# EAGLE schematic Module_SOSI_OS5000_datalogger (EAGLE 6.5.0)
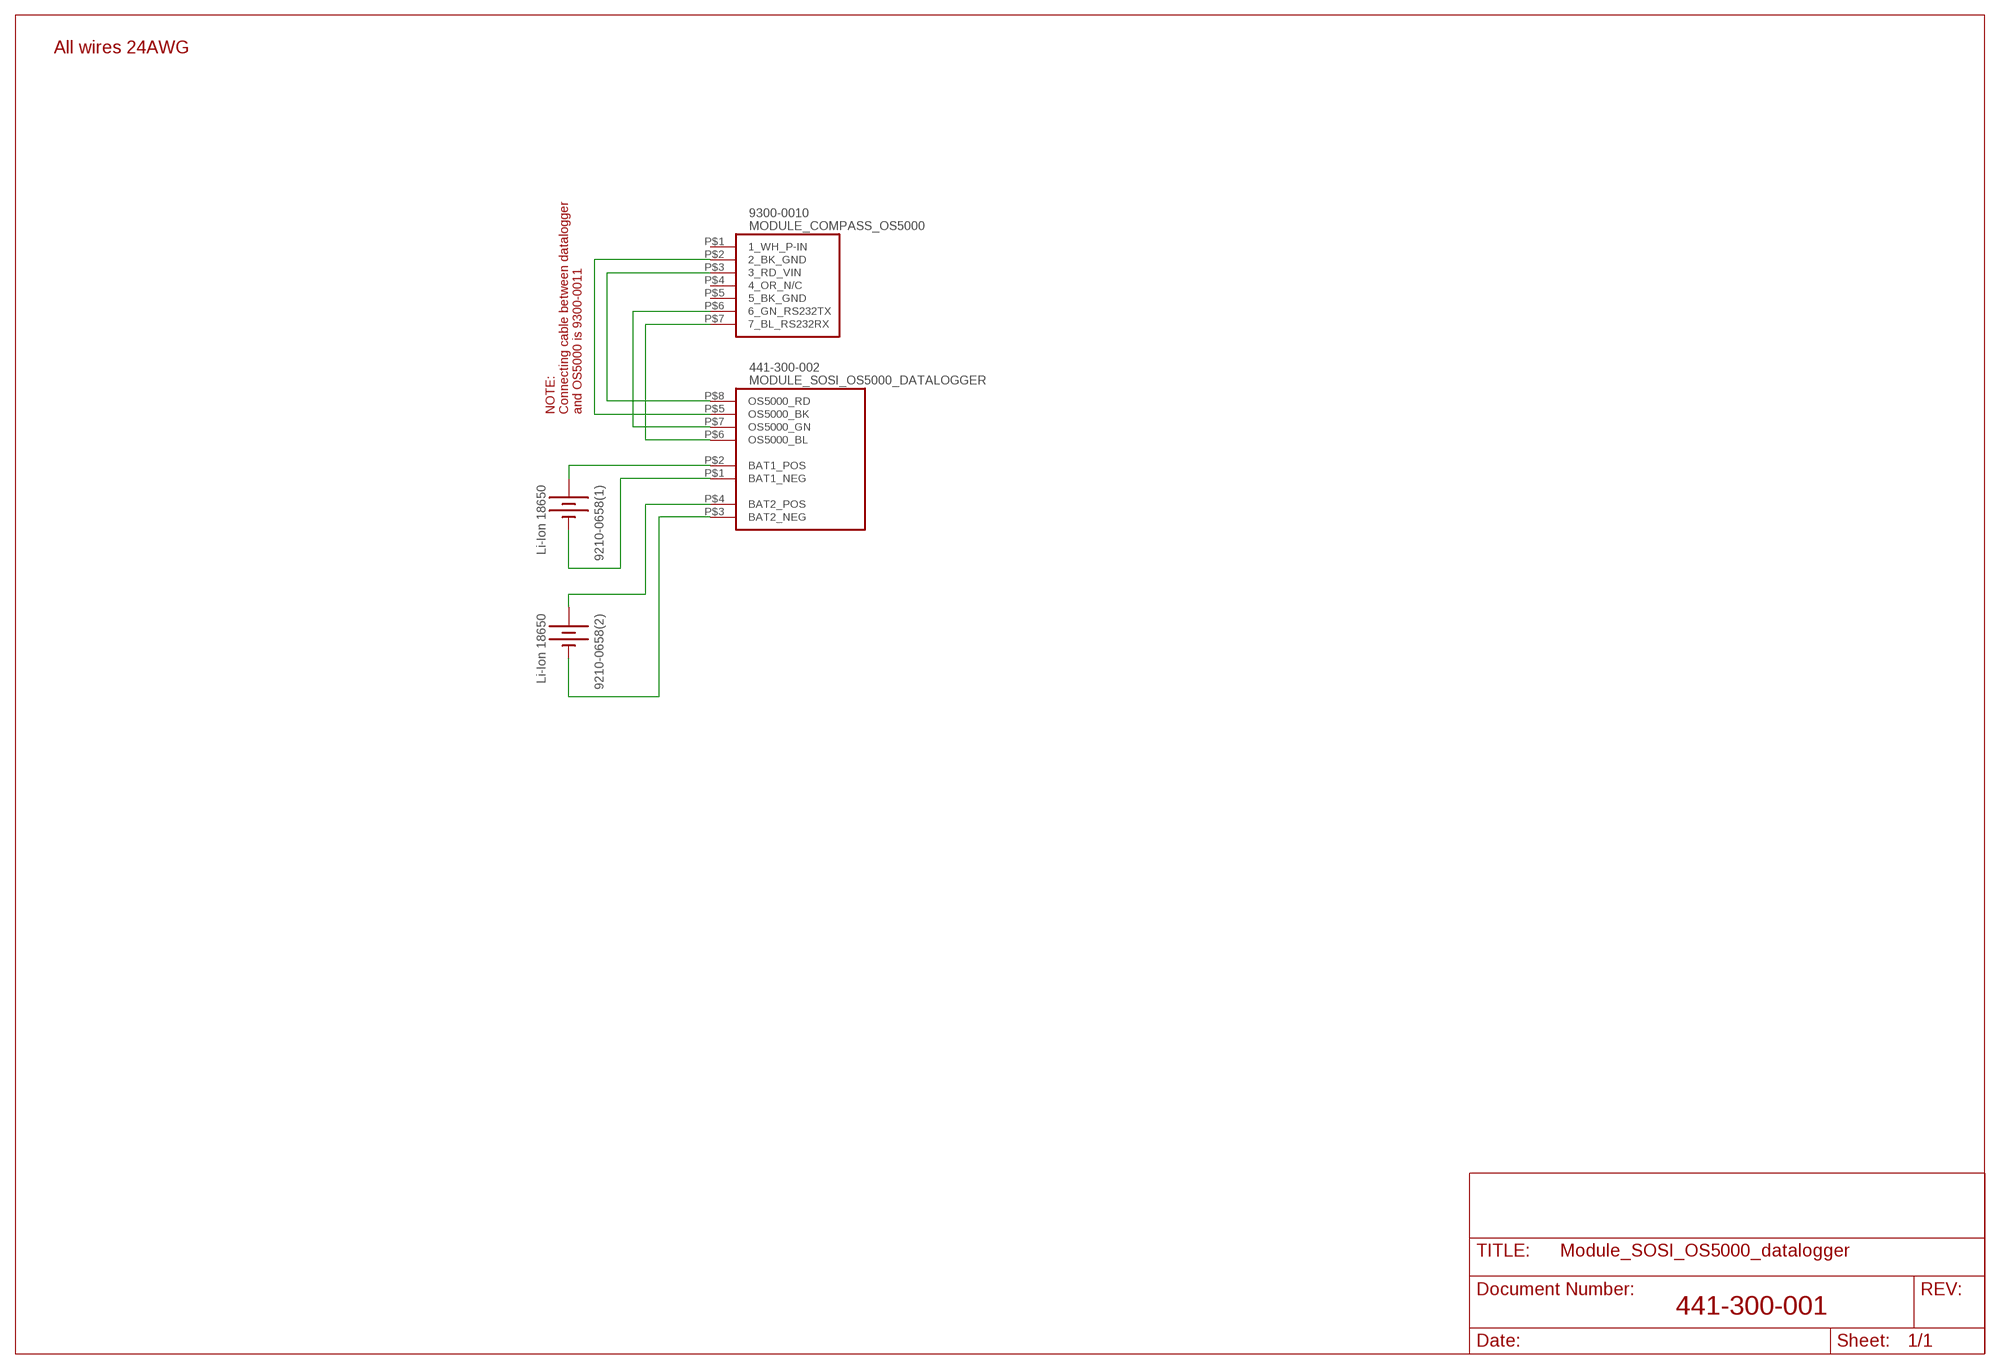
[diagram p0: schematic, sheet 1]

## Parts
441-300-002  MODULE_SOSI_OS5000_DATALOGGER  [BOGUS]
9210-0658(1)  Li-Ion 18650  BATTERY  [BOGUS]
9210-0658(2)  Li-Ion 18650  BATTERY  [BOGUS]
9300-0010  MODULE_COMPASS_OS5000  [BOGUS]

## Nets
N$1: 441-300-002.P$5(OS5000_BK) 9300-0010.P$2(2_BK_GND)
N$2: 441-300-002.P$8(OS5000_RD) 9300-0010.P$3(3_RD_VIN)
N$3: 441-300-002.P$7(OS5000_GN) 9300-0010.P$6(6_GN_RS232TX)
N$4: 441-300-002.P$6(OS5000_BL) 9300-0010.P$7(7_BL_RS232RX)
N$5: 441-300-002.P$2(BAT1_POS) 9210-0658(1).P$1(+)
N$6: 441-300-002.P$1(BAT1_NEG) 9210-0658(1).P$2(-)
N$7: 441-300-002.P$4(BAT2_POS) 9210-0658(2).P$1(+)
N$8: 441-300-002.P$3(BAT2_NEG) 9210-0658(2).P$2(-)
Unconnected: 9300-0010.P$1(1_WH_P-IN) 9300-0010.P$4(4_OR_N/C) 9300-0010.P$5(5_BK_GND)

## Notes on the sheet
- All wires 24AWG
- NOTE:
  Connecting cable between datalogger
  and OS5000 is 9300-0011
- 441-300-001

## Library data of the parts
441-300-002 = DougM-SOSI-Wiring-Diagram.rpt:MODULE_SOSI_OS5000_DATALOGGER: 441-300-002 PCB SOSI 441-300-002 SOSI 441-300-002
9210-0658(1) 9210-0658(2) = DougM-SOSI-Wiring-Diagram.rpt:BATTERY: 9210-0658 AT: Tenergy Li-Ion 18650 3.7V 2600mAh Rechargeable Battery w/ PCB & Molex Connector all-battery.com 30011-02 all-battery.com 30011-02
9300-0010 = DougM-SOSI-Wiring-Diagram.rpt:MODULE_COMPASS_OS5000: 9300-0010 OS5000-T 3 Axis Digital Compass (TTL ) Ocean Server OS5000-T OceanServer Technology, Inc. OS5000-T